# Altium project DAQ_1.PrjPcb
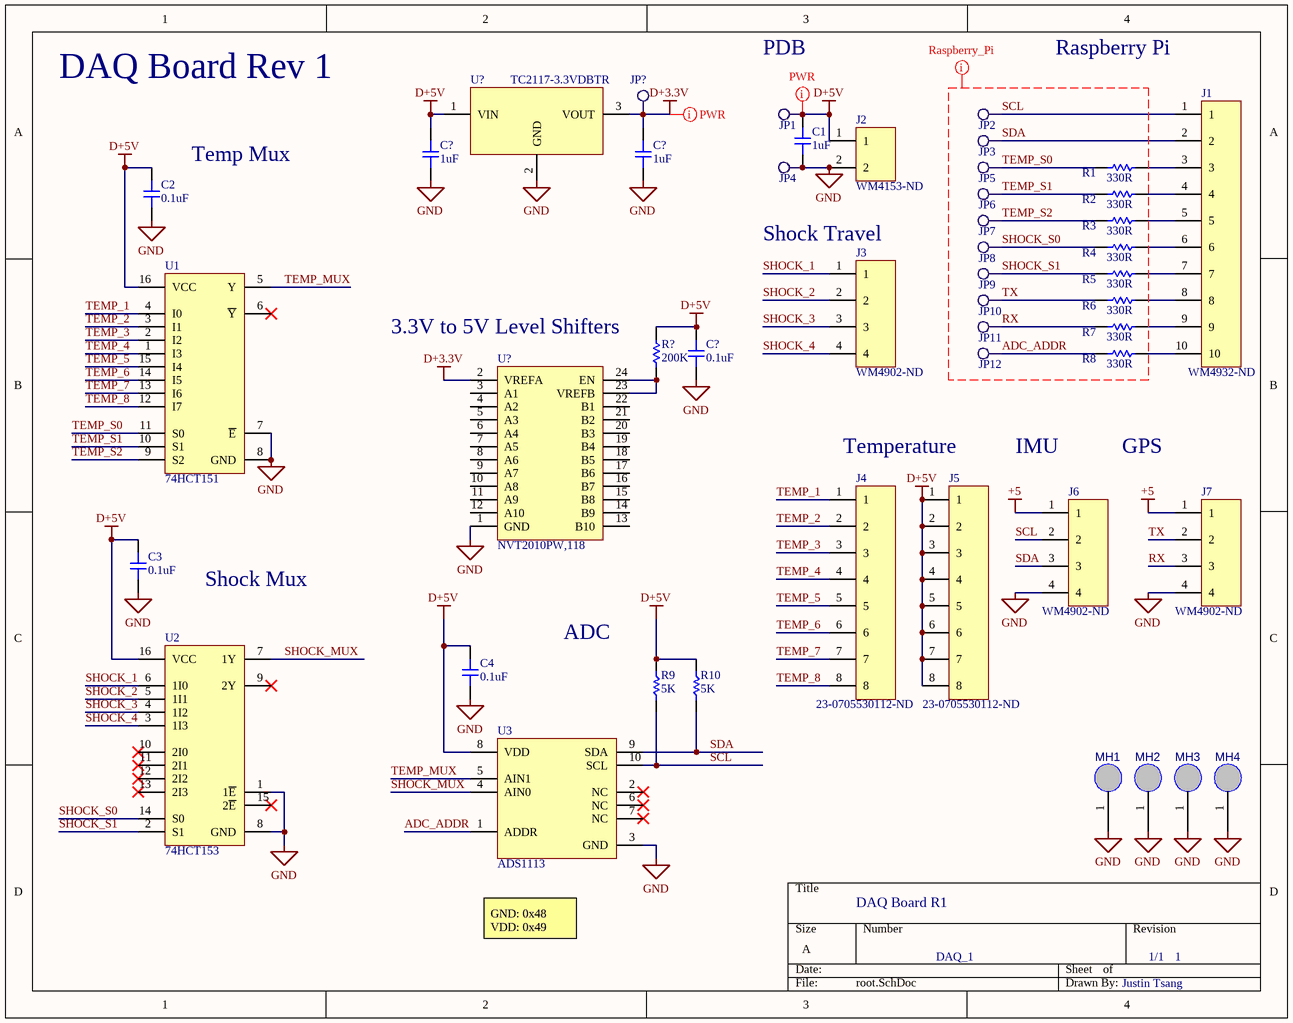
[diagram p0: root.SchDoc]
1 sheet, 47 parts. Net scope: global (net labels, ports and power ports of the same name join across sheets).
Board file: DAQ_1.PcbDoc

## Sheet root.SchDoc
size A

### Parts
(Parts that share a designator on the sheet are numbered #1, #2 ... from top to bottom, then left to right.)
C1  1uF  [CAP-0603]
C2  0.1uF  [CAP-0402]
C3  0.1uF  [CAP-0402]
C4  0.1uF  [CAP-0402]
C?#1  1uF  [CAP-0603]
C?#2  1uF  [CAP-0603]
C?#3  0.1uF  [CAP-0402]
J1  WM4932-ND  [10PIN]
J2  WM4153-ND  [2PIN]
J3  WM4902-ND  [4PIN]
J4  23-0705530112-ND  [8PIN]
J5  23-0705530112-ND  [8PIN]
J6  WM4902-ND  [4PIN]
J7  WM4902-ND  [4PIN]
JP1  Testpoint2  [TP2]  (value not drawn)
JP2  Testpoint2  [TP2]  (value not drawn)
JP3  Testpoint2  [TP2]  (value not drawn)
JP4  Testpoint2  [TP2]  (value not drawn)
JP5  Testpoint2  [TP2]  (value not drawn)
JP6  Testpoint2  [TP2]  (value not drawn)
JP7  Testpoint2  [TP2]  (value not drawn)
JP8  Testpoint2  [TP2]  (value not drawn)
JP9  Testpoint2  [TP2]  (value not drawn)
JP10  Testpoint2  [TP2]  (value not drawn)
JP11  Testpoint2  [TP2]  (value not drawn)
JP12  Testpoint2  [TP2]  (value not drawn)
JP?  Testpoint2  [TP2]  (value not drawn)
MH1  MountingHole  [MH4.2MM]  (value not drawn)
MH2  MountingHole  [MH4.2MM]  (value not drawn)
MH3  MountingHole  [MH4.2MM]  (value not drawn)
MH4  MountingHole  [MH4.2MM]  (value not drawn)
R1  330R  [RES-0402]
R2  330R  [RES-0402]
R3  330R  [RES-0402]
R4  330R  [RES-0402]
R5  330R  [RES-0402]
R6  330R  [RES-0402]
R7  330R  [RES-0402]
R8  330R  [RES-0402]
R9  5K  [RES-0603]
R10  5K  [RES-0603]
R?  200K  [RES-0402]
U1  74HCT151  [SOT127P400X1000-16N]
U2  74HCT153  [SOT127P400X1000-16N]
U3  ADS1113  [VSSOP50P310X310-10P]
U?#1  TC2117-3.3VDBTR  [SOT223]
U?#2  NVT2010PW,118  [TSSOP24]

### Nets
+5: J6.1 J7.1
D+3.3V: C?#2.2 JP?.1 U?#1.3(VOUT) U?#2.2(VREFA)
D+5V: C1.2 C2.2 C3.2 C4.2 C?#1.2 C?#3.2 J2.1 J5.1 J5.2 J5.3 J5.4 J5.5 J5.6 J5.7 J5.8 JP1.1 R9.2 R10.2 R?.2 U1.16(VCC) U2.16(VCC) U3.8(VDD) U?#1.1(VIN)
GND: C1.1 C2.1 C3.1 C4.1 C?#1.1 C?#2.1 C?#3.1 J2.2 J6.4 J7.4 JP4.1 MH1.1 MH2.1 MH3.1 MH4.1 U1.7(~{E}) U1.8(GND) U2.1(1~{E}) U2.8(GND) U3.3(GND) U?#1.2(GND) U?#2.1(GND)
ADC_ADDR: JP12.1 R8.1 U3.1(ADDR)
RX: J7.3 JP11.1 R7.1
SCL: J1.1 J6.2 JP2.1 R9.1 U3.10(SCL)
SDA: J1.2 J6.3 JP3.1 R10.1 U3.9(SDA)
SHOCK_1: J3.1 U2.6(1I0)
SHOCK_2: J3.2 U2.5(1I1)
SHOCK_3: J3.3 U2.4(1I2)
SHOCK_4: J3.4 U2.3(1I3)
SHOCK_MUX: U2.7(1Y) U3.4(AIN0)
SHOCK_S0: JP8.1 R4.1 U2.14(S0)
SHOCK_S1: JP9.1 R5.1 U2.2(S1)
TEMP_1: J4.1 U1.4(I0)
TEMP_2: J4.2 U1.3(I1)
TEMP_3: J4.3 U1.2(I2)
TEMP_4: J4.4 U1.1(I3)
TEMP_5: J4.5 U1.15(I4)
TEMP_6: J4.6 U1.14(I5)
TEMP_7: J4.7 U1.13(I6)
TEMP_8: J4.8 U1.12(I7)
TEMP_MUX: U1.5(Y) U3.5(AIN1)
TEMP_S0: JP5.1 R1.1 U1.11(S0)
TEMP_S1: JP6.1 R2.1 U1.10(S1)
TEMP_S2: JP7.1 R3.1 U1.9(S2)
TX: J7.2 JP10.1 R6.1
NetJ1_3: J1.3 R1.2
NetJ1_4: J1.4 R2.2
NetJ1_5: J1.5 R3.2
NetJ1_6: J1.6 R4.2
NetJ1_7: J1.7 R5.2
NetJ1_8: J1.8 R6.2
NetJ1_9: J1.9 R7.2
NetJ1_10: J1.10 R8.2
NetR?_1: R?.1 U?#2.23(VREFB) U?#2.24(EN)

Not connected (* = marked no-connect by the designer): U1 6(~{Y})*; U2 9(2Y)* 10(2I0)* 11(2I1)* 12(2I2)* 13(2I3)* 15(2~{E})*; U3 2(NC)* 6(NC)* 7(NC)*; U?#2 3(A1) 4(A2) 5(A3) 6(A4) 7(A5) 8(A6) 9(A7) 10(A8) 11(A9) 12(A10) 13(B10) 14(B9) 15(B8) 16(B7) 17(B6) 18(B5) 19(B4) 20(B3) 21(B2) 22(B1)

### Layout directives
mark named PWR: D+3.3V, D+5V
mark named Raspberry_Pi: ADC_ADDR, RX, SCL, SDA, SHOCK_S0, SHOCK_S1, TEMP_S0, TEMP_S1, TEMP_S2, TX

### Notes on the sheet
- DAQ Board Rev 1
- PDB
- Raspberry Pi
- (near C2) Temp Mux
- (near J3) Shock Travel
- (near R?) 3.3V to 5V Level Shifters
- Temperature
- IMU
- GPS
- Shock Mux
- ADC
- DAQ Board R1
- (near U3) GND: 0x48
  VDD: 0x49
- DAQ_1
- 1/1
- 1
- Justin Tsang

### Library data of the parts
C1 C?#1 C?#2 = 0603-1uF-16V: CAP CER 1UF 16V X7R 0603; Manufacturer: KEMET; Manufacturer Part Number: C0603C105K4RACTU; Dielectric Material: Ceramic; Tolerance: 10%; Dissipation Factor: 3.5%; Supplier 1: Digi-Key; Stock 1: 600463; Pricing 1: 1=0.12, 10=0.088, 100=0.0391, 500=0.02792, 1000=0.02193 (USD); Mount: Surface Mount,PCB; Case/Package: 0603; Number of Pins: 2; Case Code (Metric): 1608; Case Code (Imperial): 0603; Contact Plating: Tin,Matte; Min Operating Temperature: -55°C; Max Operating Temperature: 125°C; Package Quantity: 4000; Capacitance: 1uF; Voltage Rating: 16V; Packaging: Tape and Reel; Voltage Rating (DC): 16V; Dielectric: X7R; Termination: SMD/SMT; Voltage: 16V; Length: 1.6mm; Height: 0.8mm; Width: 0.031inch; Thickness: 0.034inch; Depth: 0.8mm; Radiation Hardening: No; REACH SVHC: No SVHC; ComponentLink1URL: http://www.mouser.com/ds/2/212/KEM_C1002_X7R_SMD-1102033.pdf?src-supplier=Mouser; ComponentLink1Description: http://www.mouser.com/ds/2/212/KEM_C1002_X7R_SMD-1102033.pdf?src-supplier=Mouser; ComponentLink2URL: http://www.kemet.com/kemet/web/homepage/kechome.nsf/file/Commercial%20Ceramic%20Chips%20X7R%20Dielectric/$file/KEM_C1002_X7R_SMD.pdf?src-supplier=Element14; ComponentLink2Description: http://www.kemet.com/kemet/web/homepage/kechome.nsf/file/Commercial%20Ceramic%20Chips%20X7R%20Dielectric/$file/KEM_C1002_X7R_SMD.pdf?src-supplier=Element14; ComponentLink3URL: https://www.verical.com/server-webapp/html/getDatasheet?partID=385479&src-supplier=Verical; ComponentLink3Description: https://www.verical.com/server-webapp/html/getDatasheet?partID=385479&src-supplier=Verical; ComponentLink4URL: http://www.kemet.com/kemet/web/homepage/kechome.nsf/vapubfiles/KEM_C1002_X7R_SMD.pdf/$file/KEM_C1002_X7R_SMD.pdf?src-supplier=Element14; ComponentLink4Description: http://www.kemet.com/kemet/web/homepage/kechome.nsf/vapubfiles/KEM_C1002_X7R_SMD.pdf/$file/KEM_C1002_X7R_SMD.pdf?src-supplier=Element14; Supplier Part Number 1: 399-7847-6-ND
C2-C4 C?#3 = 0402-0.1uF-16V: CAP CER 0.1UF 16V Y5V 0402; Manufacturer: KEMET; Manufacturer Part Number: C0402C104Z4VACTU; Dielectric Material: Ceramic; Tolerance: 80%; Capacitance: 100nF; Supplier 1: Digi-Key; Stock 1: 1836776; Pricing 1: 1=0.1, 10=0.018, 100=0.0081, 500=0.00578, 1000=0.00454, 2500=0.00412, 5000=0.0038 (USD); Mount: Surface Mount; Case/Package: 0402; Min Operating Temperature: -30°C; Max Operating Temperature: 85°C; Packaging: Tape and Reel; Dielectric: Y5V; Voltage Rating (DC): 16V; Length: 1mm; Height: 0.5mm; Depth: 0.5mm; Radiation Hardening: No; Lead Free: Lead Free; ComponentLink1URL: https://www.verical.com/server-webapp/html/getDatasheet?partID=764272&src-supplier=Verical; ComponentLink1Description: https://www.verical.com/server-webapp/html/getDatasheet?partID=764272&src-supplier=Verical; Supplier Part Number 1: 399-1043-6-ND
J1 = 10PIN: CONN HEADER R/A 10POS 2.54MM; Manufacturer: Molex; Manufacturer Part Number: 0705530044; Number of Positions: 10; Gender: Male; Contact Resistance: 30mR; Connector Type: Male Pin; Supplier 1: Digi-Key; Stock 1: 1173; Pricing 1: 1=2.61, 10=2.367, 100=2.0288, 500=1.69068, 1000=1.44915, 5000=1.28491 (USD); Mount: Through Hole; Housing Material: Polyester; Housing Color: Black; Contact Plating: Tin; Contact Material: Bronze; Color: Black; Min Operating Temperature: -40°C; Max Operating Temperature: 105°C; Number of Rows: 1; Packaging: Rail/Tube; Termination: Solder; Orientation: Right Angle; Number of Contacts: 10; Length: 27.95mm; Pitch: 2.54mm; Depth: 13.59mm; Contact Mating Length: 0.24inch; ComponentLink1URL: http://www.molex.com/webdocs/datasheets/pdf/en-us/0705530044_PCB_HEADERS.pdf?src-supplier=Avnet; ComponentLink1Description: http://www.molex.com/webdocs/datasheets/pdf/en-us/0705530044_PCB_HEADERS.pdf?src-supplier=Avnet; Supplier Part Number 1: WM4932-ND
J2 = 2PIN: CONN HEADER R/A 2POS 2.54MM; Manufacturer: Molex; Manufacturer Part Number: 0705530106; Number of Positions: 2; Contact Resistance: 30mR; Connector Type: Male Pin; Supplier 1: Digi-Key; Stock 1: 2224; Pricing 1: 1=1.38, 10=1.25, 100=1.071, 500=0.8925, 1000=0.765, 5000=0.6783, 10000=0.663 (USD); Mount: Through Hole; Housing Material: Polyester; Contact Plating: Gold; Contact Material: Bronze; Color: Black; Housing Color: Black; Min Operating Temperature: -40°C; Max Operating Temperature: 105°C; Number of Rows: 1; Packaging: Rail/Tube; Termination: Solder; Number of Contacts: 2; Orientation: Right Angle; Length: 7.37mm; Pitch: 2.54mm; Depth: 13.59mm; Contact Mating Length: 0.24inch; ComponentLink1URL: http://www.molex.com/webdocs/datasheets/pdf/en-us/0705530106_PCB_HEADERS.pdf?src-supplier=Avnet+Asia; ComponentLink1Description: http://www.molex.com/webdocs/datasheets/pdf/en-us/0705530106_PCB_HEADERS.pdf?src-supplier=Avnet+Asia; ComponentLink2URL: https://www.molex.com/pdm_docs/ps/PS-70400.pdf?src-supplier=Digi-Key; ComponentLink2Description: https://www.molex.com/pdm_docs/ps/PS-70400.pdf?src-supplier=Digi-Key; Supplier Part Number 1: WM4153-ND
J3 J6 J7 = 4PIN: CONN HEADER R/A 4POS 2.54MM; Manufacturer: Molex; Manufacturer Part Number: 70553-0003; Number of Positions: 4; Gender: Male; Current Rating: 3A; Voltage Rating: 250V; Contact Resistance: 30mR; Insulation Resistance: 1GR; Approvals: UL,CSA; Glow Wire Compliant: Non-compliant; Supplier 1: Digi-Key; Stock 1: 4238; Pricing 1: 1=1.05, 10=0.927, 100=0.7995, 500=0.65412, 1000=0.58144, 5000=0.50876, 10000=0.48332 (USD); Mount: Through Hole; Color: Black; Housing Color: Black; Housing Material: Polycyclohexylenedimethylene; Contact Material: Bronze,Copper Alloy; Contact Plating: Gold; Material: Brass; Min Operating Temperature: -40°C; Max Operating Temperature: 105°C; Packaging: Rail/Tube; Termination: Through Hole; Number of Rows: 1; Orientation: Right Angle; Package Quantity: 1680; Number of Contacts: 4; Number of Circuits: 4; Voltage Rating (DC): 250V; Pitch: 2.54mm; REACH SVHC: Unknown; ELV: Compliant; Lead Free: Lead Free; Flammability Rating: UL94 V-0; ComponentLink1URL: http://www.molex.com/webdocs/datasheets/pdf/en-us/0705530003_PCB_HEADERS.pdf?src-supplier=Mouser; ComponentLink1Description: http://www.molex.com/webdocs/datasheets/pdf/en-us/0705530003_PCB_HEADERS.pdf?src-supplier=Mouser; ComponentLink2URL: http://www.jameco.com/Jameco/Products/ProdDS/884758.pdf?src-supplier=Jameco; ComponentLink2Description: http://www.jameco.com/Jameco/Products/ProdDS/884758.pdf?src-supplier=Jameco; ComponentLink3URL: http://uk.rs-online.com/webdocs/13c4/0900766b813c4977.pdf?src-supplier=RSComponents; ComponentLink3Description: http://uk.rs-online.com/webdocs/13c4/0900766b813c4977.pdf?src-supplier=RSComponents; Supplier Part Number 1: WM4902-ND
J4 J5 = 8PIN: CONN HEADER R/A 8POS 2.54MM; Manufacturer: Molex; Manufacturer Part Number: 70553-0112; Contact Resistance: 30mR; Current Rating: 3A; Voltage Rating: 250V; Number of Positions: 8; Insulation Resistance: 1GR; Connector Type: Male Pin; Glow Wire Compliant: Non-compliant; Supplier 1: Digi-Key; Stock 1: 1363; Pricing 1: 1=2.43, 10=2.205, 100=1.89, 500=1.575, 1000=1.35, 5000=1.197, 10000=1.17 (USD); Mount: Through Hole; Color: Black; Contact Material: Bronze; Contact Plating: Gold; Material: Brass; Housing Material: Thermoplastic; Min Operating Temperature: -40°C; Max Operating Temperature: 105°C; Package Quantity: 1; Number of Rows: 1; Packaging: Rail/Tube; Termination: Solder; Number of Contacts: 8; Orientation: Right Angle; Voltage Rating (DC): 250V; Number of Circuits: 8; Pitch: 2.54mm; Contact Mating Length: 0.24inch; ELV: Compliant; Flammability Rating: UL94 V-0; ComponentLink1URL: https://www.molex.com/pdm_docs/ps/PS-70400.pdf?src-supplier=Digi-Key; ComponentLink1Description: https://www.molex.com/pdm_docs/ps/PS-70400.pdf?src-supplier=Digi-Key; ComponentLink2URL: http://www.mouser.com/ds/2/276/0705530112_PCB_HEADERS-172840.pdf?src-supplier=Mouser; ComponentLink2Description: http://www.mouser.com/ds/2/276/0705530112_PCB_HEADERS-172840.pdf?src-supplier=Mouser; Supplier Part Number 1: 23-0705530112-ND
JP1-JP12 JP? = Testpoint2: Single layer pad TP
MH1-MH4 = MH4.2mm: Mounting hole, 4.2mm; Case: TH
R1-R8 = 0402-330R: RES SMD 330R OHM 5% 1/10W 0402; ComponentLink1URL: https://industrial.panasonic.com/cdbs/www-data/pdf/RDA0000/AOA0000C301.pdf?src-supplier=Future+Electronics; ComponentLink1Description: https://industrial.panasonic.com/cdbs/www-data/pdf/RDA0000/AOA0000C301.pdf?src-supplier=Future+Electronics; ComponentLink2URL: http://www.jameco.com/Jameco/Products/ProdDS/1986781.pdf?src-supplier=Jameco; ComponentLink2Description: http://www.jameco.com/Jameco/Products/ProdDS/1986781.pdf?src-supplier=Jameco; ComponentLink3URL: http://www.farnell.com/datasheets/2059623.pdf?src-supplier=Farnell; ComponentLink3Description: http://www.farnell.com/datasheets/2059623.pdf?src-supplier=Farnell; ComponentLink4URL: http://industrial.panasonic.com/www-data/pdf/AOA0000/AOA0000CE1.pdf?src-supplier=Avnet; ComponentLink4Description: http://industrial.panasonic.com/www-data/pdf/AOA0000/AOA0000CE1.pdf?src-supplier=Avnet; ComponentLink5URL: http://www.alliedelec.com/m/d/51cd0790071e1666bdb9d00c57fcf960.pdf?src-supplier=Allied+Electronics; ComponentLink5Description: http://www.alliedelec.com/m/d/51cd0790071e1666bdb9d00c57fcf960.pdf?src-supplier=Allied+Electronics; ComponentLink6URL: http://industrial.panasonic.com/www-data/pdf/AOA0000/AOA0000CE1.pdf?src-supplier=Avnet+Europe; ComponentLink6Description: http://industrial.panasonic.com/www-data/pdf/AOA0000/AOA0000CE1.pdf?src-supplier=Avnet+Europe; ComponentLink7URL: http://www.farnell.com/datasheets/2059623.pdf?src-supplier=Element14; ComponentLink7Description: http://www.farnell.com/datasheets/2059623.pdf?src-supplier=Element14; ComponentLink8URL: http://industrial.panasonic.com/cdbs/www-data/pdf/RDA0000/AOA0000C301.pdf?src-supplier=Farnell; ComponentLink8Description: http://industrial.panasonic.com/cdbs/www-data/pdf/RDA0000/AOA0000C301.pdf?src-supplier=Farnell
R9 R10 = 0603-5KR: RES SMD 4.99K OHM 1% 1/10W 0603; Manufacturer: Bourns; Manufacturer Part Number: CR0603-FX-4991ELF; Resistance: 4.99kR; Power Rating: 100mW; Voltage Rating: 50V; Temperature Coefficient: 100ppm/°C; Supplier 1: Digi-Key; Stock 1: 70557; Pricing 1: 1=0.1, 10=0.02, 25=0.0144, 50=0.011, 100=0.0082, 250=0.00624, 500=0.00498, 1000=0.00367 (USD); Mount: Surface Mount; Case/Package: 0603; Case Code (Imperial): 0603; Case Code (Metric): 1608; Contact Plating: Tin; Min Operating Temperature: -55°C; Max Operating Temperature: 155°C; Tolerance: 1%; Packaging: Tape and Reel; Package Quantity: 1; Composition: Thick Film; Termination: SMD/SMT; Number of Terminations: 2; Max Power Dissipation: 100mW; Features: Moisture Resistant; Length: 0.063inch; Height: 0.022inch; Width: 0.8mm; Thickness: 457um; Radiation Hardening: No; ComponentLink1URL: https://www.bourns.com/docs/Product-Datasheets/CHPREZTR.pdf?src-supplier=Digi-Key; ComponentLink1Description: https://www.bourns.com/docs/Product-Datasheets/CHPREZTR.pdf?src-supplier=Digi-Key; ComponentLink2URL: http://www.bourns.com/pdfs/chpreztr.pdf?src-supplier=Avnet; ComponentLink2Description: http://www.bourns.com/pdfs/chpreztr.pdf?src-supplier=Avnet; Supplier Part Number 1: CR0603-FX-4991ELFDKR-ND
R? = 0402-200K: RES SMD 330R OHM 5% 1/10W 0402; ComponentLink1URL: https://industrial.panasonic.com/cdbs/www-data/pdf/RDA0000/AOA0000C301.pdf?src-supplier=Future+Electronics; ComponentLink1Description: https://industrial.panasonic.com/cdbs/www-data/pdf/RDA0000/AOA0000C301.pdf?src-supplier=Future+Electronics; ComponentLink2URL: http://www.jameco.com/Jameco/Products/ProdDS/1986781.pdf?src-supplier=Jameco; ComponentLink2Description: http://www.jameco.com/Jameco/Products/ProdDS/1986781.pdf?src-supplier=Jameco; ComponentLink3URL: http://www.farnell.com/datasheets/2059623.pdf?src-supplier=Farnell; ComponentLink3Description: http://www.farnell.com/datasheets/2059623.pdf?src-supplier=Farnell; ComponentLink4URL: http://industrial.panasonic.com/www-data/pdf/AOA0000/AOA0000CE1.pdf?src-supplier=Avnet; ComponentLink4Description: http://industrial.panasonic.com/www-data/pdf/AOA0000/AOA0000CE1.pdf?src-supplier=Avnet; ComponentLink5URL: http://www.alliedelec.com/m/d/51cd0790071e1666bdb9d00c57fcf960.pdf?src-supplier=Allied+Electronics; ComponentLink5Description: http://www.alliedelec.com/m/d/51cd0790071e1666bdb9d00c57fcf960.pdf?src-supplier=Allied+Electronics; ComponentLink6URL: http://industrial.panasonic.com/www-data/pdf/AOA0000/AOA0000CE1.pdf?src-supplier=Avnet+Europe; ComponentLink6Description: http://industrial.panasonic.com/www-data/pdf/AOA0000/AOA0000CE1.pdf?src-supplier=Avnet+Europe; ComponentLink7URL: http://www.farnell.com/datasheets/2059623.pdf?src-supplier=Element14; ComponentLink7Description: http://www.farnell.com/datasheets/2059623.pdf?src-supplier=Element14; ComponentLink8URL: http://industrial.panasonic.com/cdbs/www-data/pdf/RDA0000/AOA0000C301.pdf?src-supplier=Farnell; ComponentLink8Description: http://industrial.panasonic.com/cdbs/www-data/pdf/RDA0000/AOA0000C301.pdf?src-supplier=Farnell
U1 = IC_74HCT151: 8-input multiplexer
U2 = IC_74HCT153: Dual 4-input multiplexer
U3 = IC_ADS111x: ADS111x Ultra-Small, Low-Power, I / 2C-Compatible, 860-SPS, 16-Bit ADCs / With Internal Reference, Oscillator, and Programmable Comparator
U?#1 = LDO-3.3V-800mA: IC REG LIN 3.3V 800MA SOT223-3; Manufacturer: Microchip; Dropout Voltage: 1.2V; Max Input Voltage: 6V; Min Input Voltage: 2.7V; Number of Outputs: 1; Polarity: Positive; Accuracy: 0.5%; Quiescent Current: 80uA; Output Type: Fixed; Supplier 1: Digi-Key; Manufacturer Part Number: TC2117-3.3VDBTR; Stock 1: 3126; Pricing 1: 1=0.73, 25=0.61, 100=0.55 (USD); Mount: Surface Mount; Case/Package: SOT-223-3; Number of Pins: 3; Min Operating Temperature: -40°C; Max Operating Temperature: 125°C; Output Current: 800mA; Max Output Current: 800mA; Output Voltage: 3.3V; Max Supply Voltage: 6V; Min Supply Voltage: 2.7V; Package Quantity: 4000; Packaging: Tape and Reel; Nominal Output Voltage: 3.3V; Number of Regulators: 1; Min Output Voltage: 3.3V; Max Output Voltage: 3.3V; Termination: SMD/SMT; Length: 6.7mm; Height: 1.7mm; Width: 3.7mm; Radiation Hardening: No; REACH SVHC: No SVHC; Lead Free: Lead Free; ComponentLink1URL: http://www.farnell.com/datasheets/1669439.pdf?src-supplier=Element14; ComponentLink1Description: http://www.farnell.com/datasheets/1669439.pdf?src-supplier=Element14; ComponentLink2URL: http://ww1.microchip.com/downloads/en/DeviceDoc/21665D.pdf?src-supplier=Avnet+Europe; ComponentLink2Description: http://ww1.microchip.com/downloads/en/DeviceDoc/21665D.pdf?src-supplier=Avnet+Europe; ComponentLink3URL: http://www.microchip.com/mymicrochip/filehandler.aspx?ddocname=en023833&src-supplier=Digi-Key; ComponentLink3Description: http://www.microchip.com/mymicrochip/filehandler.aspx?ddocname=en023833&src-supplier=Digi-Key; ComponentLink4URL: http://ww1.microchip.com/downloads/en/DeviceDoc/21665D.pdf?src-supplier=Future+Electronics; ComponentLink4Description: http://ww1.microchip.com/downloads/en/DeviceDoc/21665D.pdf?src-supplier=Future+Electronics; ComponentLink5URL: http://ww1.microchip.com/downloads/en/DeviceDoc/21665D.pdf?src-supplier=Avnet; ComponentLink5Description: http://ww1.microchip.com/downloads/en/DeviceDoc/21665D.pdf?src-supplier=Avnet; ComponentLink6URL: http://www.farnell.com/datasheets/1669439.pdf?src-supplier=Newark; ComponentLink6Description: http://www.farnell.com/datasheets/1669439.pdf?src-supplier=Newark; Supplier Part Number 1: TC2117-3.3VDBDKR-ND
U?#2 = IC_NVT2010PW: Bidirectional voltage level translators operational from 1.0 V / to 3.6 V (Vref(A)) and 1.8 V to 5.5 V (Vref(B)),